# EAGLE design main-stm32 (EAGLE 8.7.0)
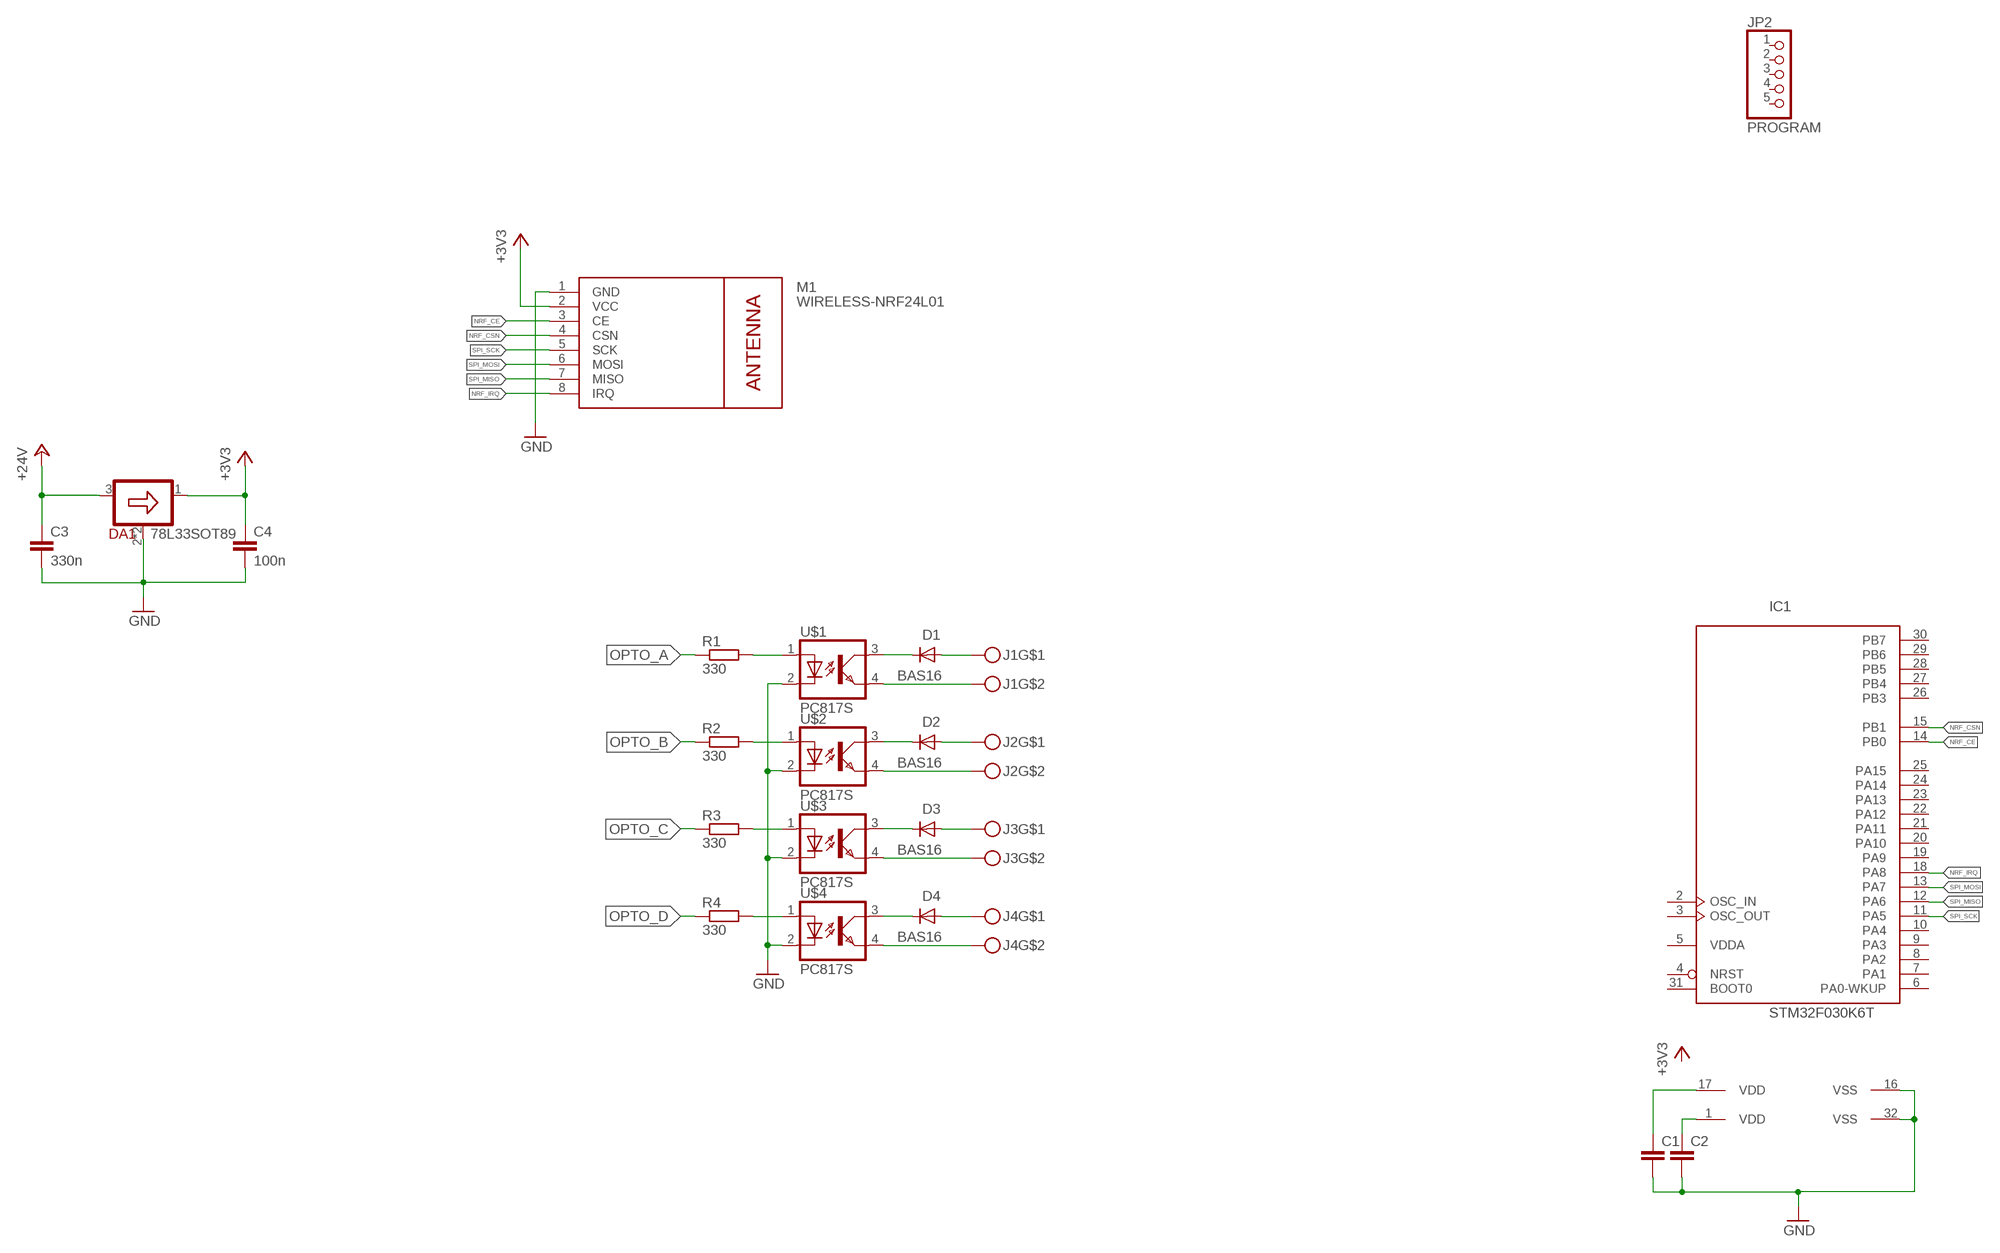
[diagram p0: schematic, sheet 1]

## Parts
C1  C-EUC1206  [C1206]
C2  C-EUC1206  [C1206]
C3  330n  C-EUC1206  [C1206]
C4  100n  C-EUC1206  [C1206]
D1  BAS16  [SOT23]
D2  BAS16  [SOT23]
D3  BAS16  [SOT23]
D4  BAS16  [SOT23]
DA1  78L33SOT89  [SOT89]
IC1  STM32F030K6T  [LQFP32]
J1  SCREW-TERMINAL-2PIN  [PITCH4.3-PIN2]
J2  SCREW-TERMINAL-2PIN  [PITCH4.3-PIN2]
J3  SCREW-TERMINAL-2PIN  [PITCH4.3-PIN2]
J4  SCREW-TERMINAL-2PIN  [PITCH4.3-PIN2]
JP2  PROGRAM  PINHD-1X5  [1X05]
M1  WIRELESS-NRF24L01  [WIRELESS-NRF24L01]
R1  330  R-EU_R1206  [R1206]
R2  330  R-EU_R1206  [R1206]
R3  330  R-EU_R1206  [R1206]
R4  330  R-EU_R1206  [R1206]
U$1  PC817S  [SMD4-7]
U$2  PC817S  [SMD4-7]
U$3  PC817S  [SMD4-7]
U$4  PC817S  [SMD4-7]

## Nets
+3V3: C4.1 DA1.1(OUT) M1.2(VCC)
+24V: C3.1 DA1.3(IN)
GND: C1.2 C2.2 C3.2 C4.2 DA1.2(GND) DA1.2@1(GND) IC1.16(VSS) IC1.32(VSS) M1.1(GND) U$1.2(C) U$2.2(C) U$3.2(C) U$4.2(C)
N$1: C1.1 IC1.17(VDD)
N$2: C2.1 IC1.1(VDD)
N$3: R1.2 U$1.1(A)
N$4: R2.2 U$2.1(A)
N$5: D1.3(K) U$1.3(COL)
N$6: D2.3(K) U$2.3(COL)
N$7: D3.3(K) U$3.3(COL)
N$8: D4.3(K) U$4.3(COL)
N$9: D1.1(A) J1.1
N$10: J1.2 U$1.4(EMIT)
N$11: D2.1(A) J2.1
N$12: J2.2 U$2.4(EMIT)
N$13: D3.1(A) J3.1
N$14: J3.2 U$3.4(EMIT)
N$15: D4.1(A) J4.1
N$16: J4.2 U$4.4(EMIT)
N$17: R3.2 U$3.1(A)
N$18: R4.2 U$4.1(A)
NRF_CE: IC1.14(PB0) M1.3(CE)
NRF_CSN: IC1.15(PB1) M1.4(CSN)
NRF_IRQ: IC1.18(PA8) M1.8(IRQ)
OPTO_A: R1.1
OPTO_B: R2.1
OPTO_C: R3.1
OPTO_D: R4.1
SPI_MISO: IC1.12(PA6) M1.7(MISO)
SPI_MOSI: IC1.13(PA7) M1.6(MOSI)
SPI_SCK: IC1.11(PA5) M1.5(SCK)
Unconnected: IC1.2(OSC_IN) IC1.3(OSC_OUT) IC1.4(NRST) IC1.6(PA0-WKUP) IC1.7(PA1) IC1.8(PA2) IC1.9(PA3) IC1.10(PA4) IC1.19(PA9) IC1.20(PA10) IC1.21(PA11) IC1.22(PA12) IC1.23(PA13) IC1.24(PA14) IC1.25(PA15) IC1.26(PB3) IC1.27(PB4) IC1.28(PB5) IC1.29(PB6) IC1.30(PB7) IC1.31(BOOT0) JP2.1 JP2.2 JP2.3 JP2.4 JP2.5

## Power pins joined to a net without a drawn wire
VDDA: IC1.5(VDDA)

## Library data of the parts
C1-C4 = rcl:C-EU: CAPACITOR, European symbol; SPICEPREFIX: C
D1-D4 = nxp_60:BAS16: High-speed switching diode High-speed switching diode, encapsulated in small Surface-Mounted Device (SMD) plastic packages. AAL Eindhoven MK
DA1 = regulators-linear:78L33
IC1 = micro-stm_v3:STM32F030K*T: ARM 32-bit Cortex™-M0 CPU 48 MHz maximum frequency 32 Kbytes of Flash memory 4 kbytes of SRAM 26 GPIOs 2.4 to 3.6 V application supply
J1-J4 = screw-terminal:SCREW-TERMINAL-2PIN
JP2 = pinhead:PINHD-1X5: PIN HEADER
M1 = diy-modules:WIRELESS-NRF24L01: 2.4 GHz Wireless Module based on NRF24L01 chip More details available here: http://www.electrodragon.com/w/NRF24L01 Click here to find device on ebay.com <http://www.ebay.com/sch/nrf24l01+arduino>
R1-R4 = rcl:R-EU_: RESISTOR, European symbol; SPICEPREFIX: R
U$1-U$4 = optocoupler-3-jcn:PC817S

## Board
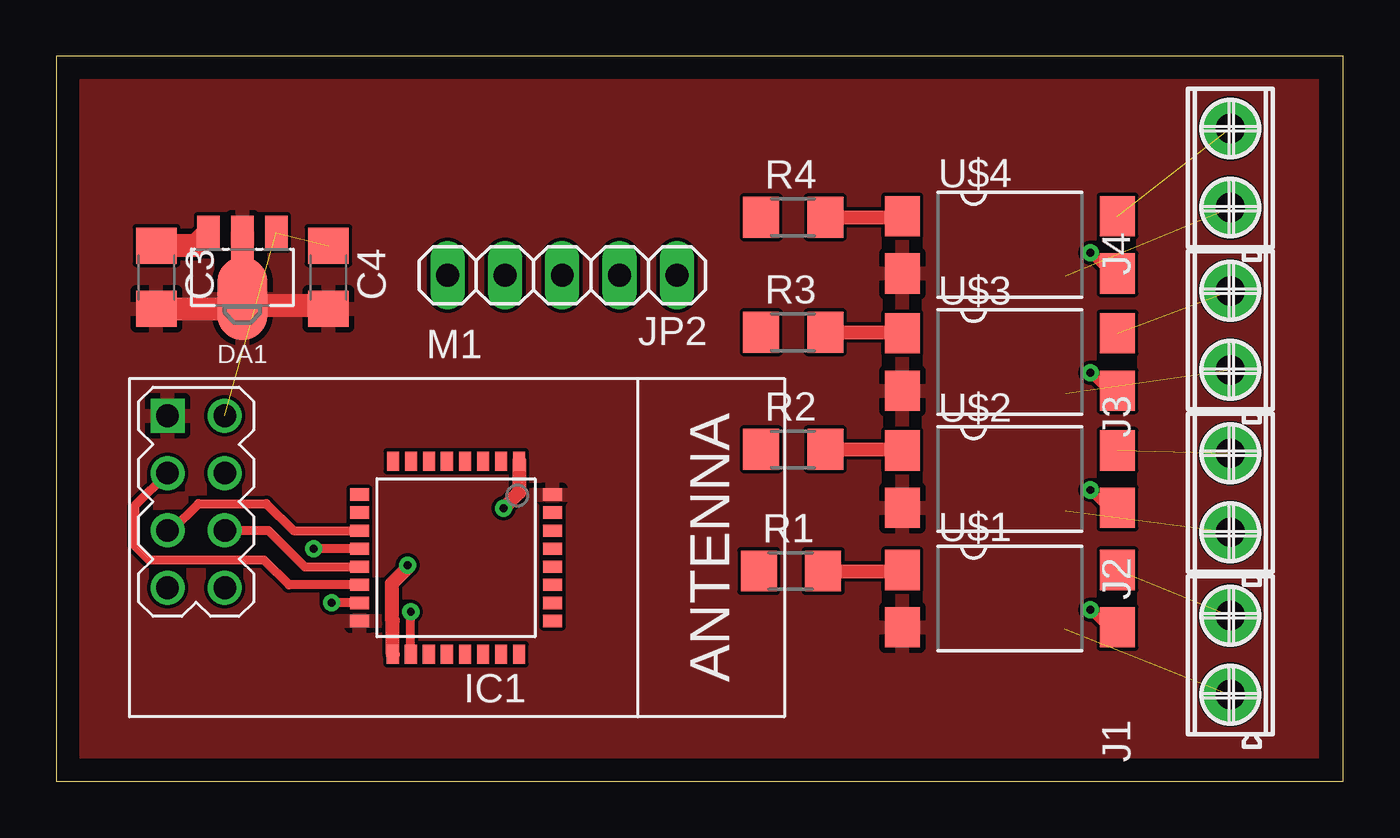
[diagram p1: board, top side]
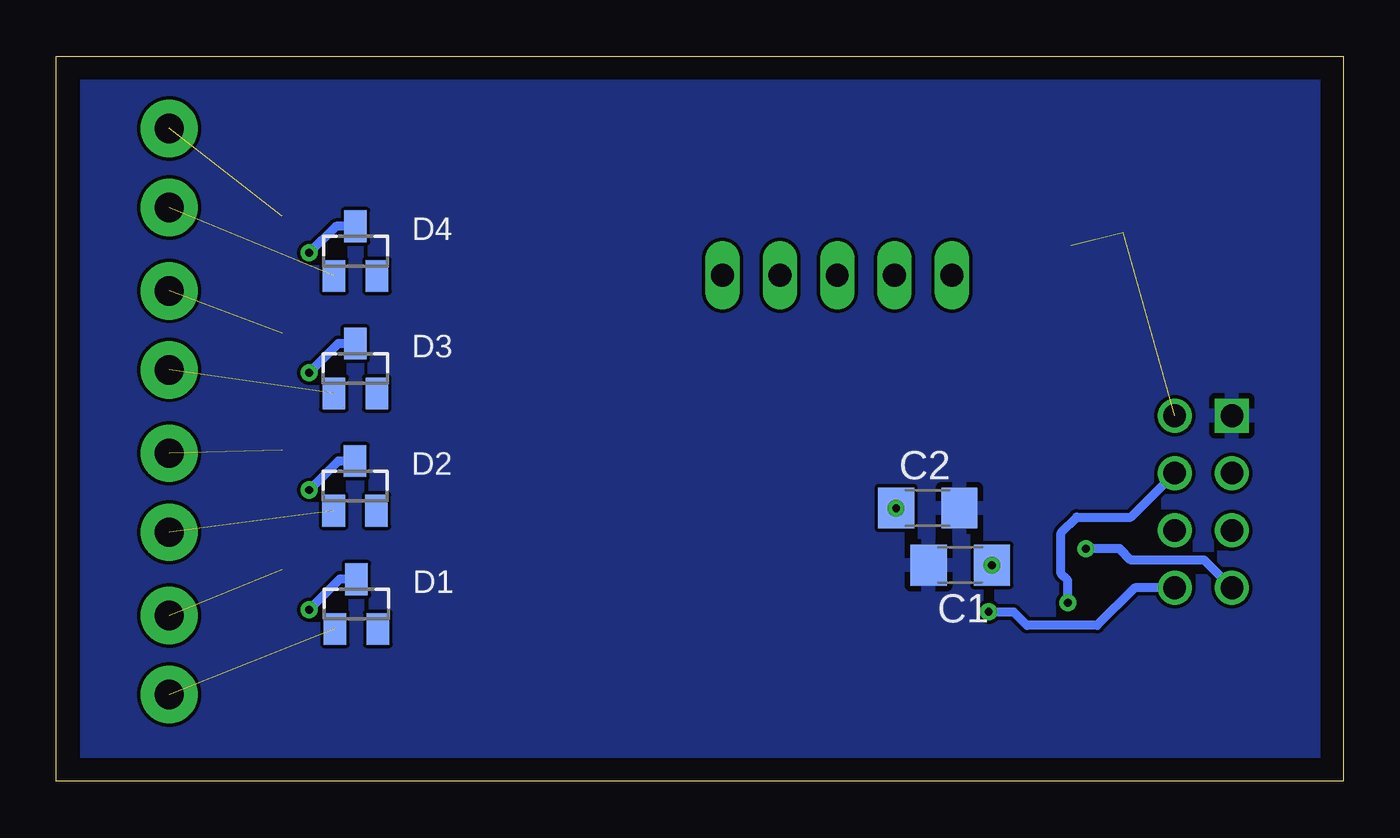
[diagram p2: board, bottom side, seen from below]

Size 57 x 32.1 mm. Coordinates in mm from the lower left corner, seen from the top.
Outline: 0,0 57,0 57,32.1 0,32.1 0,0
Copper layers (1*16): Top 0.035mm / dielectric 1.5mm / Bottom 0.035mm
Design rules "default": minimum track width 6mil, minimum drill 0.35mm, track to track 6mil, track to pad 6mil, pad to pad 6mil, via to via 6mil, smd to smd 6mil, copper to edge 40mil, drill to drill 6mil, minimum pad ring 10mil, minimum via ring 8mil, stop-mask expansion 4mil, vias tented up to drill 0mil, thermal gap 10mil

### Footprints (pad centres in the part's own frame; a part is rotated, then mirrored left to right if it is on the bottom)
C1206 = smd 1.6 x 1.8: 1 -1.4,0; 2 1.4,0
SOT23 = smd 1 x 1.4: 1 -0.95,-1.1; 2 0.95,-1.1; 3 0,1.1
SOT89 = smd 1 x 1.5: 1 -1.499,-1.981; 3 1.499,-1.981 | smd 1 x 2: 2 0,-1.727 | smd 2.2 x 3.7: 2@1 0,0.94
LQFP32 = smd 0.54 x 0.85: 1 -2.8,-4.275; 2 -2,-4.275; 3 -1.2,-4.275; 4 -0.4,-4.275; 5 0.4,-4.275; 6 1.19,-4.275; 7 1.99,-4.275; 8 2.79,-4.275; 17 2.8,4.275; 18 2,4.275; 19 1.2,4.275; 20 0.4,4.275; 21 -0.4,4.275; 22 -1.2,4.275; 23 -2,4.275; 24 -2.8,4.275 | smd 0.85 x 0.54: 9 4.275,-2.8; 10 4.275,-2; 11 4.275,-1.2; 12 4.275,-0.4; 13 4.275,0.4; 14 4.275,1.2; 15 4.275,2; 16 4.275,2.8; 25 -4.275,2.8; 26 -4.275,2; 27 -4.275,1.2; 28 -4.275,0.4; 29 -4.275,-0.4; 30 -4.275,-1.2; 31 -4.275,-2; 32 -4.275,-2.8
PITCH4.3-PIN2 = drill 1.3 pad 2.54: 1 -1.75,0.025; 2 1.75,0.025
1X05 = drill 1.016 long: 1 -5.08,0; 2 -2.54,0; 3 0,0; 4 2.54,0; 5 5.08,0
WIRELESS-NRF24L01 = drill 1 square: 1 -12.7,6.35 | drill 1: 2 -10.16,6.35; 3 -12.7,3.81; 4 -10.16,3.81; 5 -12.7,1.27; 6 -10.16,1.27; 7 -12.7,-1.27; 8 -10.16,-1.27
R1206 = smd 1.6 x 1.803: 1 -1.422,0; 2 1.422,0
SMD4-7 = smd 1.78 x 1.55: 1 -1.27,-4.77; 2 1.27,-4.77; 3 1.27,4.77; 4 -1.27,4.77

### Placement (x,y rotation side)
C1  16.96,9.57 180 bottom
C2  18.4,12.1 0 bottom
C3  4.43,22.32 270 top
C4  12.05,22.32 270 top
D1  43.71,7.85 0 bottom
D2  43.77,13.08 0 bottom
D3  43.76,18.28 0 bottom
D4  43.75,23.48 0 bottom
DA1  8.24,22.32 180 top
IC1  17.7,9.9 180 top
J1  52.03,5.59 90 top
J2  52.03,12.78 90 top
J3  52.03,19.97 90 top
J4  52.03,27.16 90 top
JP2  22.41,22.41 180 top
M1  17.62,9.84 0 top
R1  32.54,9.31 0 top
R2  32.64,14.7 0 top
R3  32.64,19.89 0 top
R4  32.64,24.98 0 top
U$1  42.24,8.09 270 top
U$2  42.24,13.38 270 top
U$3  42.24,18.57 270 top
U$4  42.24,23.76 270 top

### Tracks (layer width: path | path; a pad name or v marks a point on that pad's centre or on a via)
+3V3  (2 unrouted)
+24V
  Top 1.016: DA1.3 6.16,23.72 C3.1
GND
  Top 0.61: C4.2 11.92,21.05 | 8.11,20.92 8.24,21.05
  Top 1.016: 11.92,21.05 8.24,21.05 DA1.2@1 | C3.2 8.11,20.92
  pour Top: 0,32.01 0,0 55.63,0 55.63,32.01
  pour Bottom: 0,32.01 0,0 55.63,0 55.63,32.01
N$1  (via drill 0.35)
  Top 0.61: IC1.17 14.9,7.12 14.87,7.15 14.87,8.77 15.6,9.5 15.56,9.54 C1.1
  other vias: 15.56,9.57
N$2  (via drill 0.35)
  Top 0.61: IC1.1 20.5,12.8 C2.1
  other vias: 19.8,12.1
N$3
  Top 0.61: R1.2 37.42,9.31 U$1.1
N$4
  Top 0.61: R2.2 37.42,14.7 U$2.1
N$5  (via drill 0.35)
  Top 0.406: v45.8,7.6 46.58,6.82 U$1.3
  Bottom 0.406: D1.3 44.45,8.95 v45.8,7.6
N$6  (via drill 0.35)
  Top 0.406: v45.8,12.9 46.59,12.11 U$2.3
  Bottom 0.406: D2.3 44.52,14.18 v45.8,12.9
N$7  (via drill 0.35)
  Top 0.406: v45.8,18.1 46.6,17.3 U$3.3
  Bottom 0.406: D3.3 44.52,19.38 v45.8,18.1
N$8  (via drill 0.35)
  Top 0.406: v45.8,23.4 46.71,22.49 U$4.3
  Bottom 0.406: D4.3 44.62,24.58 v45.8,23.4
N$9  (1 unrouted)
N$10  (1 unrouted)
N$11  (1 unrouted)
N$12  (1 unrouted)
N$13  (1 unrouted)
N$14  (1 unrouted)
N$15  (1 unrouted)
N$16  (1 unrouted)
N$17
  Top 0.61: R3.2 37.42,19.89 U$3.1
N$18
  Top 0.61: R4.2 37.42,24.98 U$4.1
NRF_CE
  Top 0.406: IC1.14 10.3,8.7 9.2,9.8 4.1,9.8 3.5,10.4 3.5,12.23 M1.3
NRF_CSN  (via drill 0.35)
  Top 0.406: IC1.15 v12.2,7.9
  Bottom 0.406: v12.2,7.9 12.2,8.9 12.5,9.2 12.5,11 11.8,11.7 9.41,11.7 M1.4
NRF_IRQ  (via drill 0.35)
  Top 0.406: IC1.18 v15.7,7.5
  Bottom 0.406: v15.7,7.5 14.6,7.5 14,6.9 10.9,6.9 9.23,8.57 M1.8
SPI_MISO  (via drill 0.35)
  Top 0.406: IC1.12 v11.4,10.3
  Bottom 0.406: M1.7 6.15,9.8 9.4,9.8 9.9,10.3 v11.4,10.3
SPI_MOSI
  Top 0.406: M1.6 9.39,11.11 11,9.5 IC1.13
SPI_SCK
  Top 0.406: M1.5 5.11,11.11 6.3,12.3 9.3,12.3 10.5,11.1 IC1.11